# EAGLE schematic TFG_board_01 (EAGLE 7.6.0)
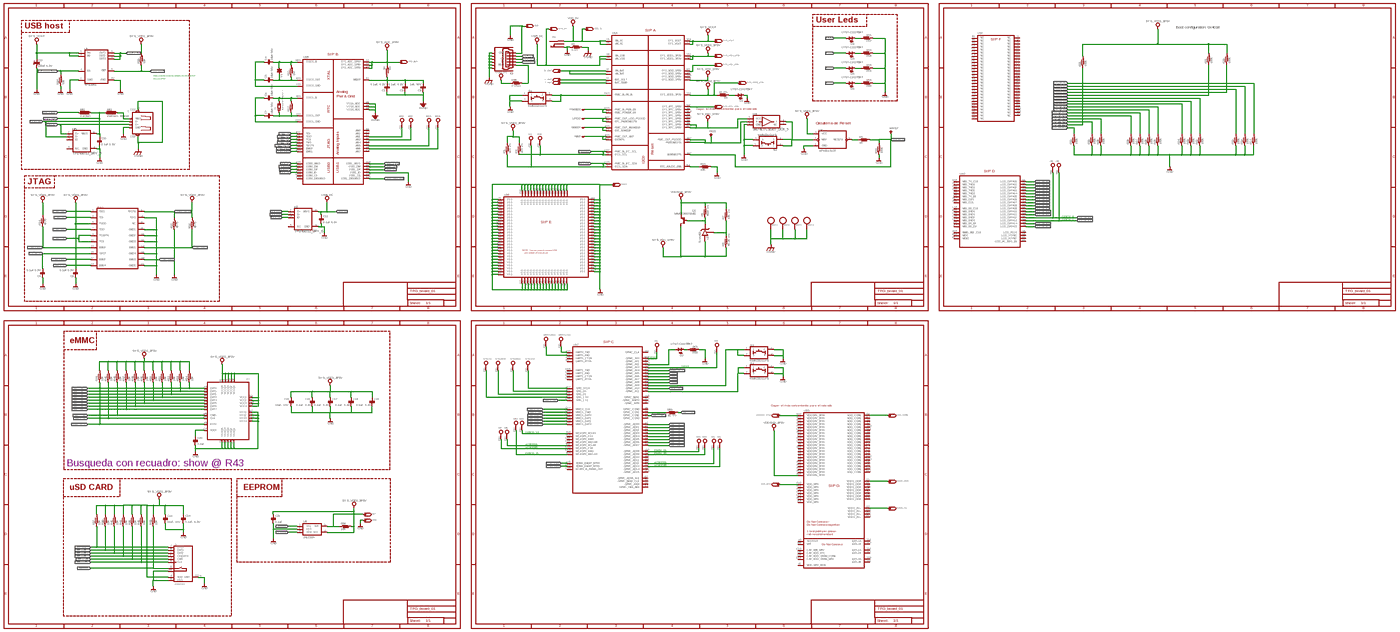
[diagram p0: schematic, sheet 1, overview]
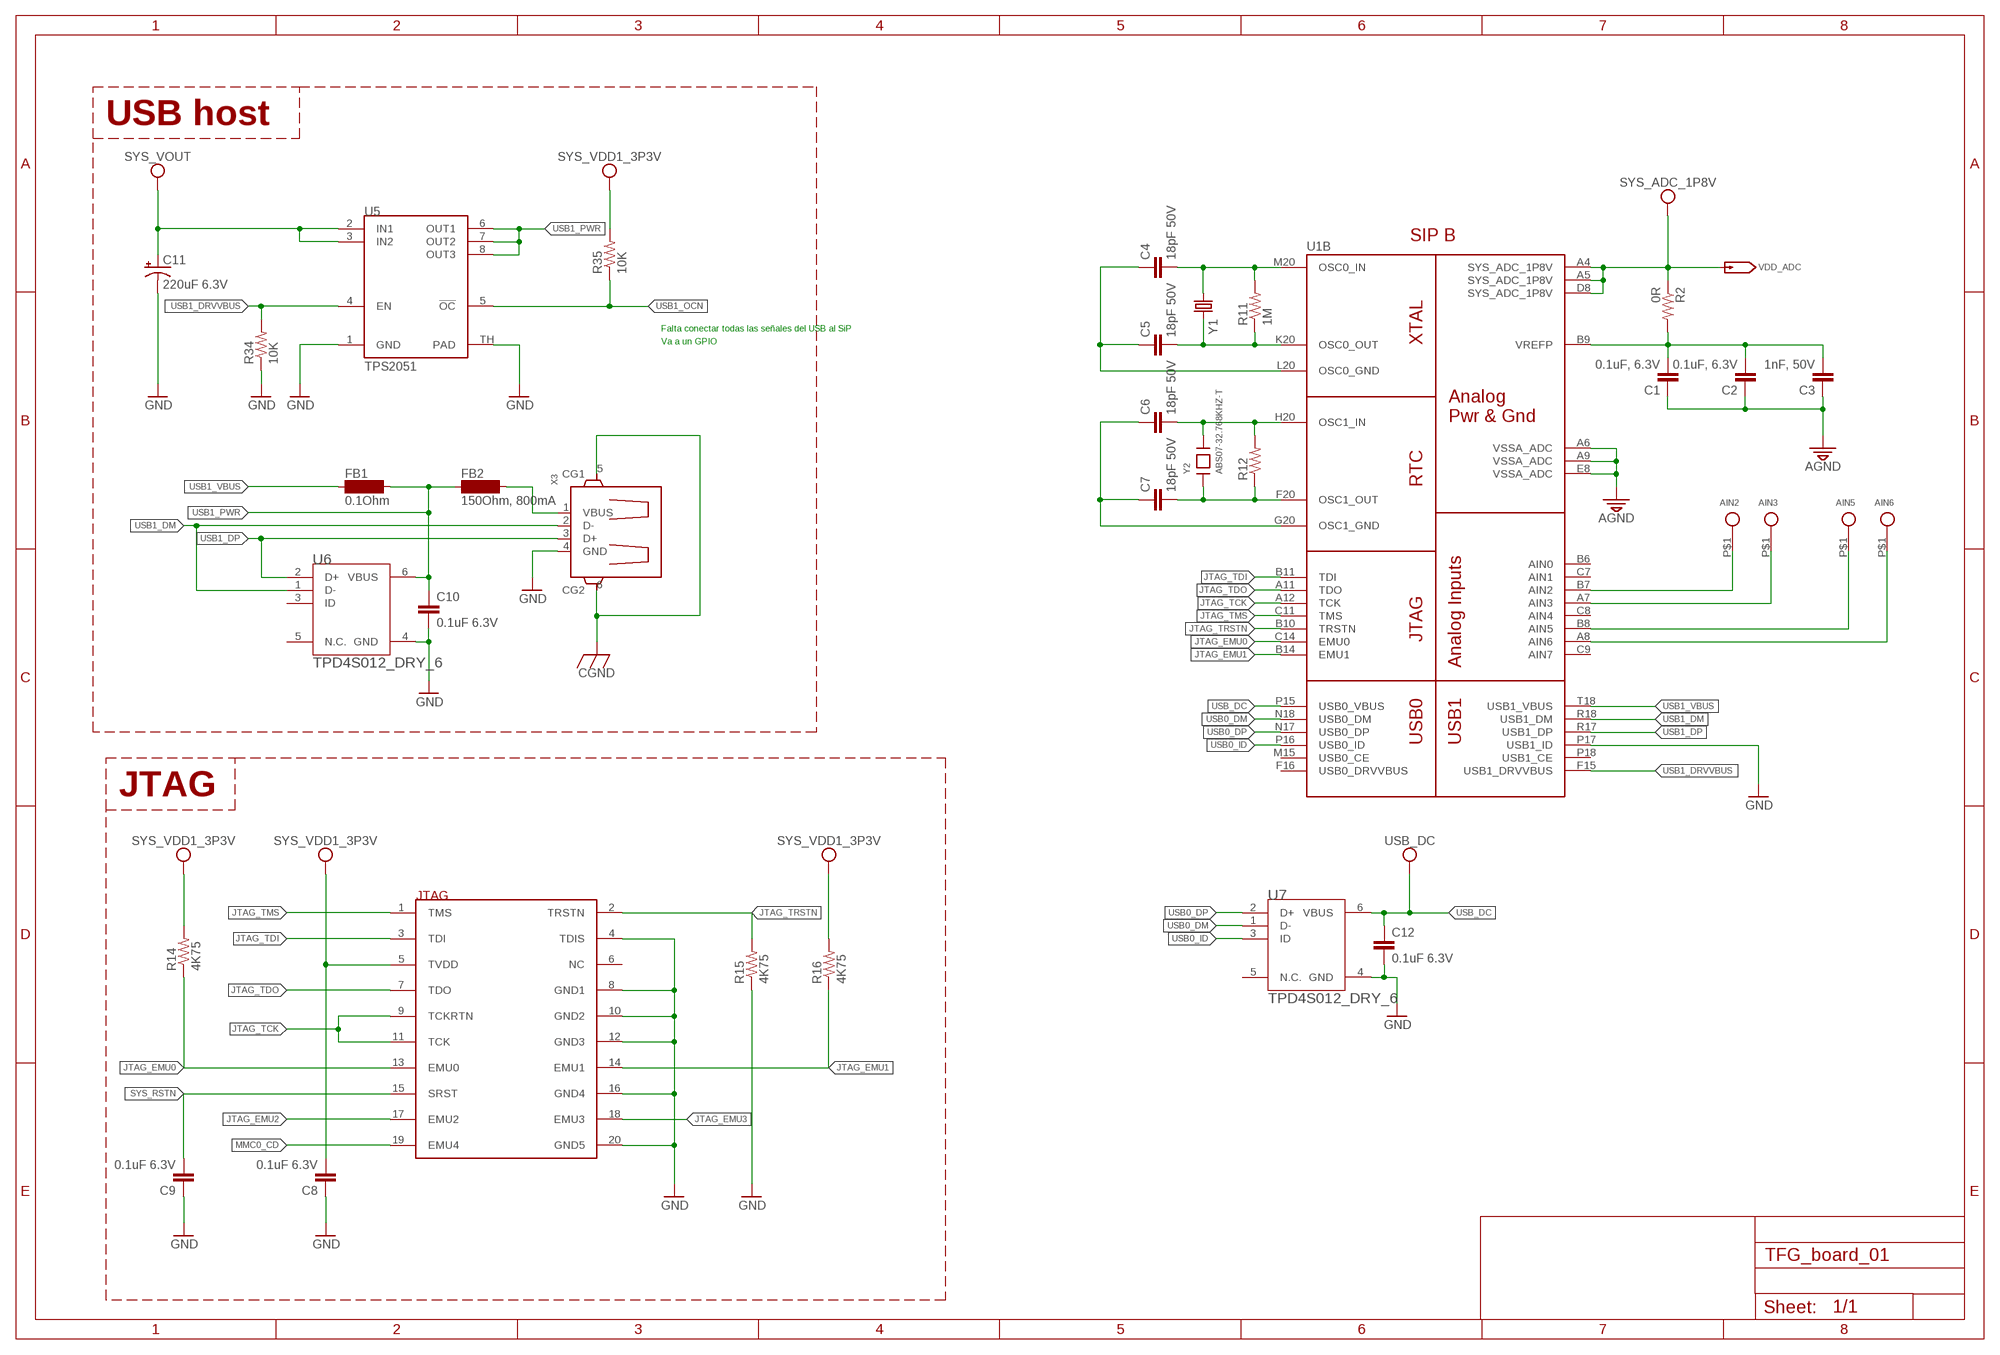
[diagram p1: schematic, sheet 1, part 1 of 7]
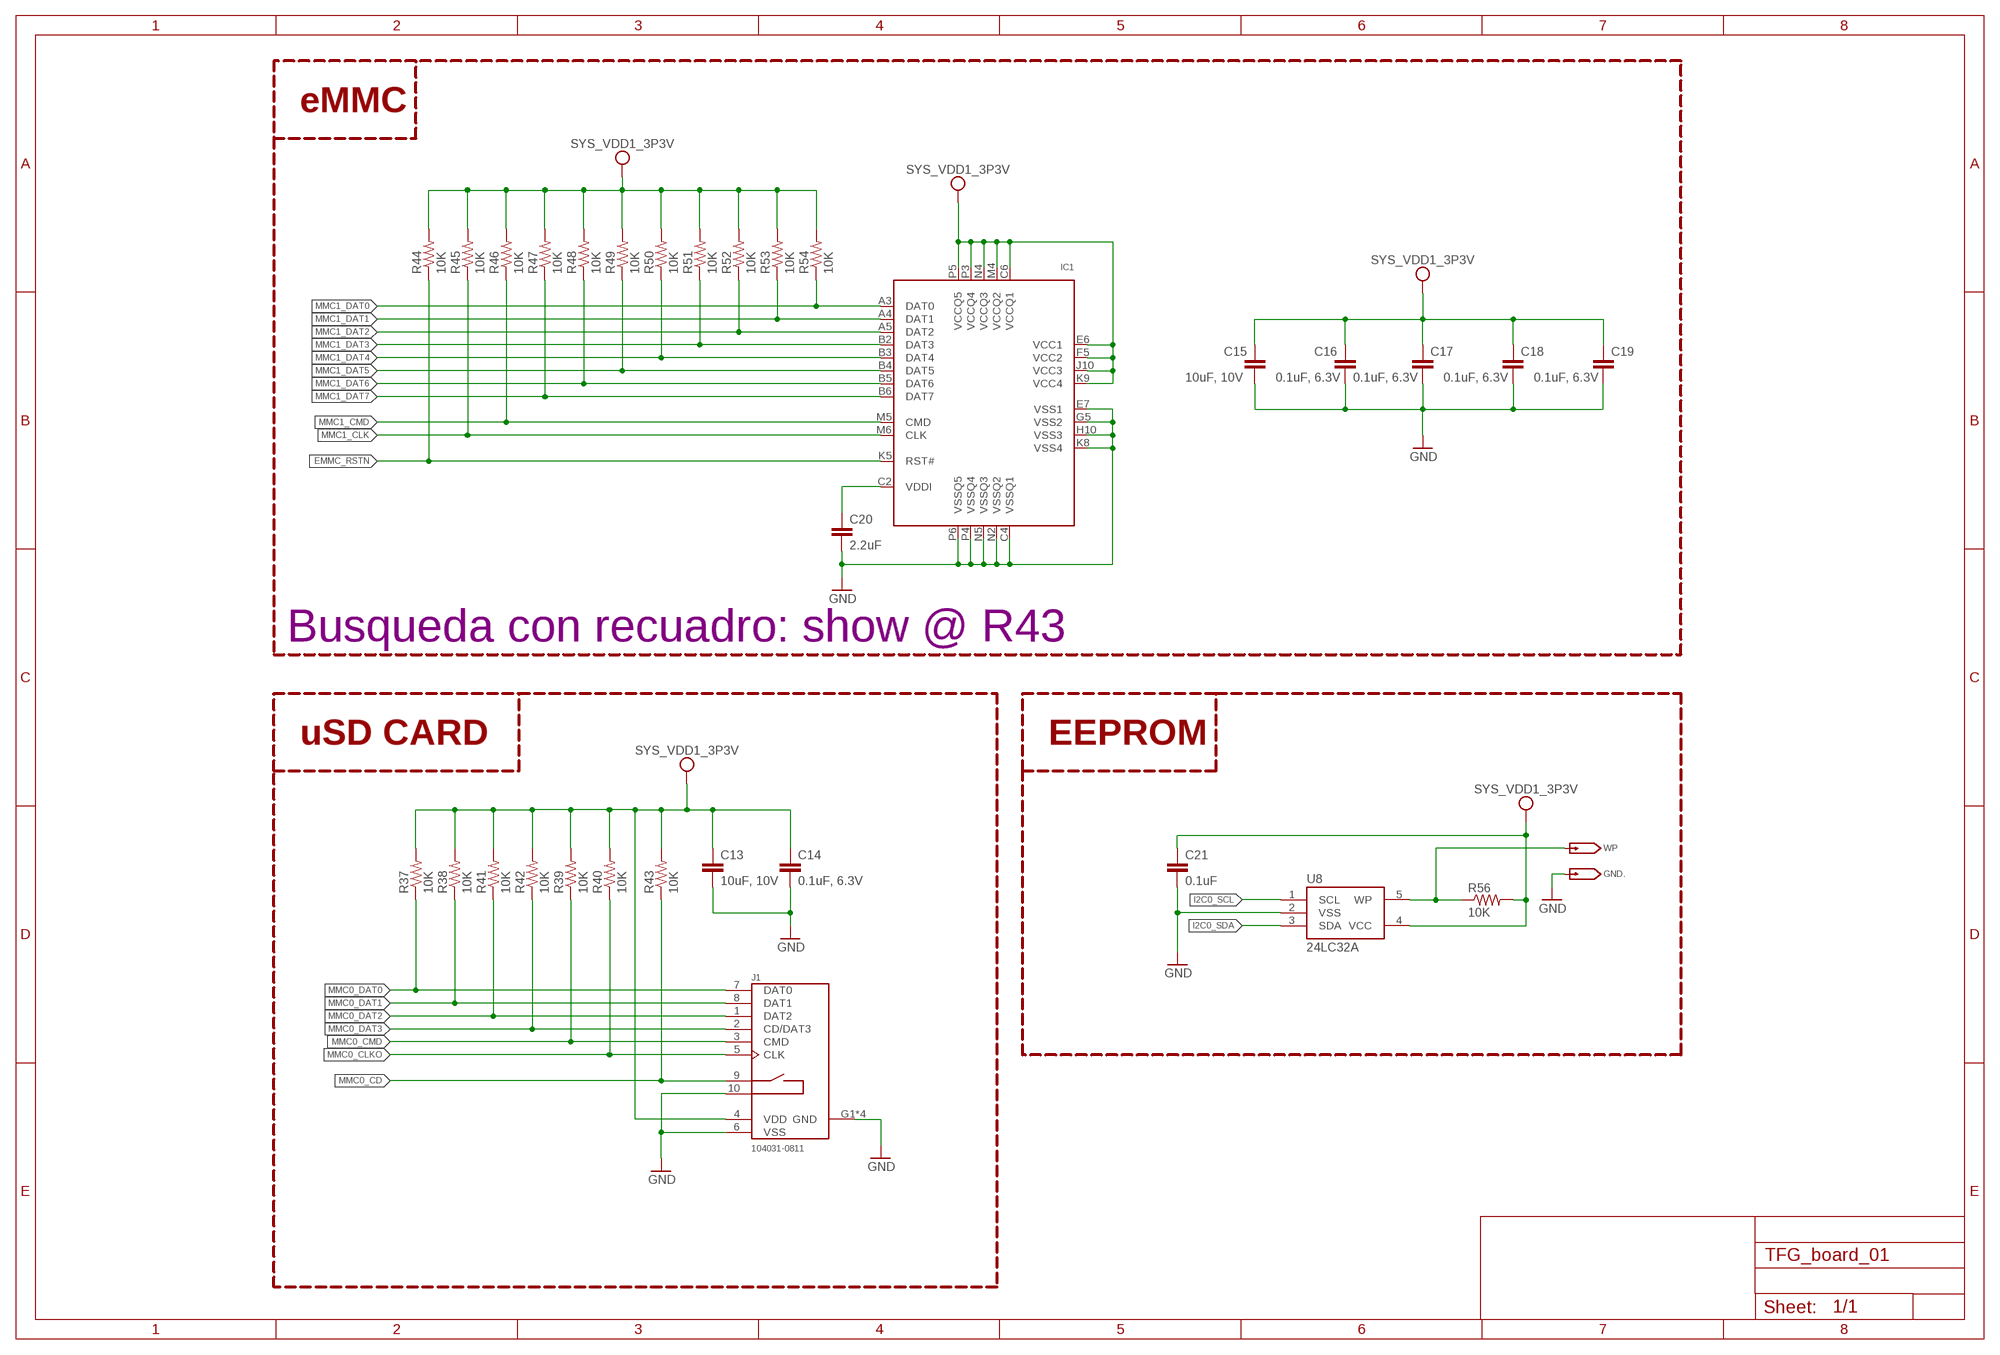
[diagram p2: schematic, sheet 1, part 2 of 7]
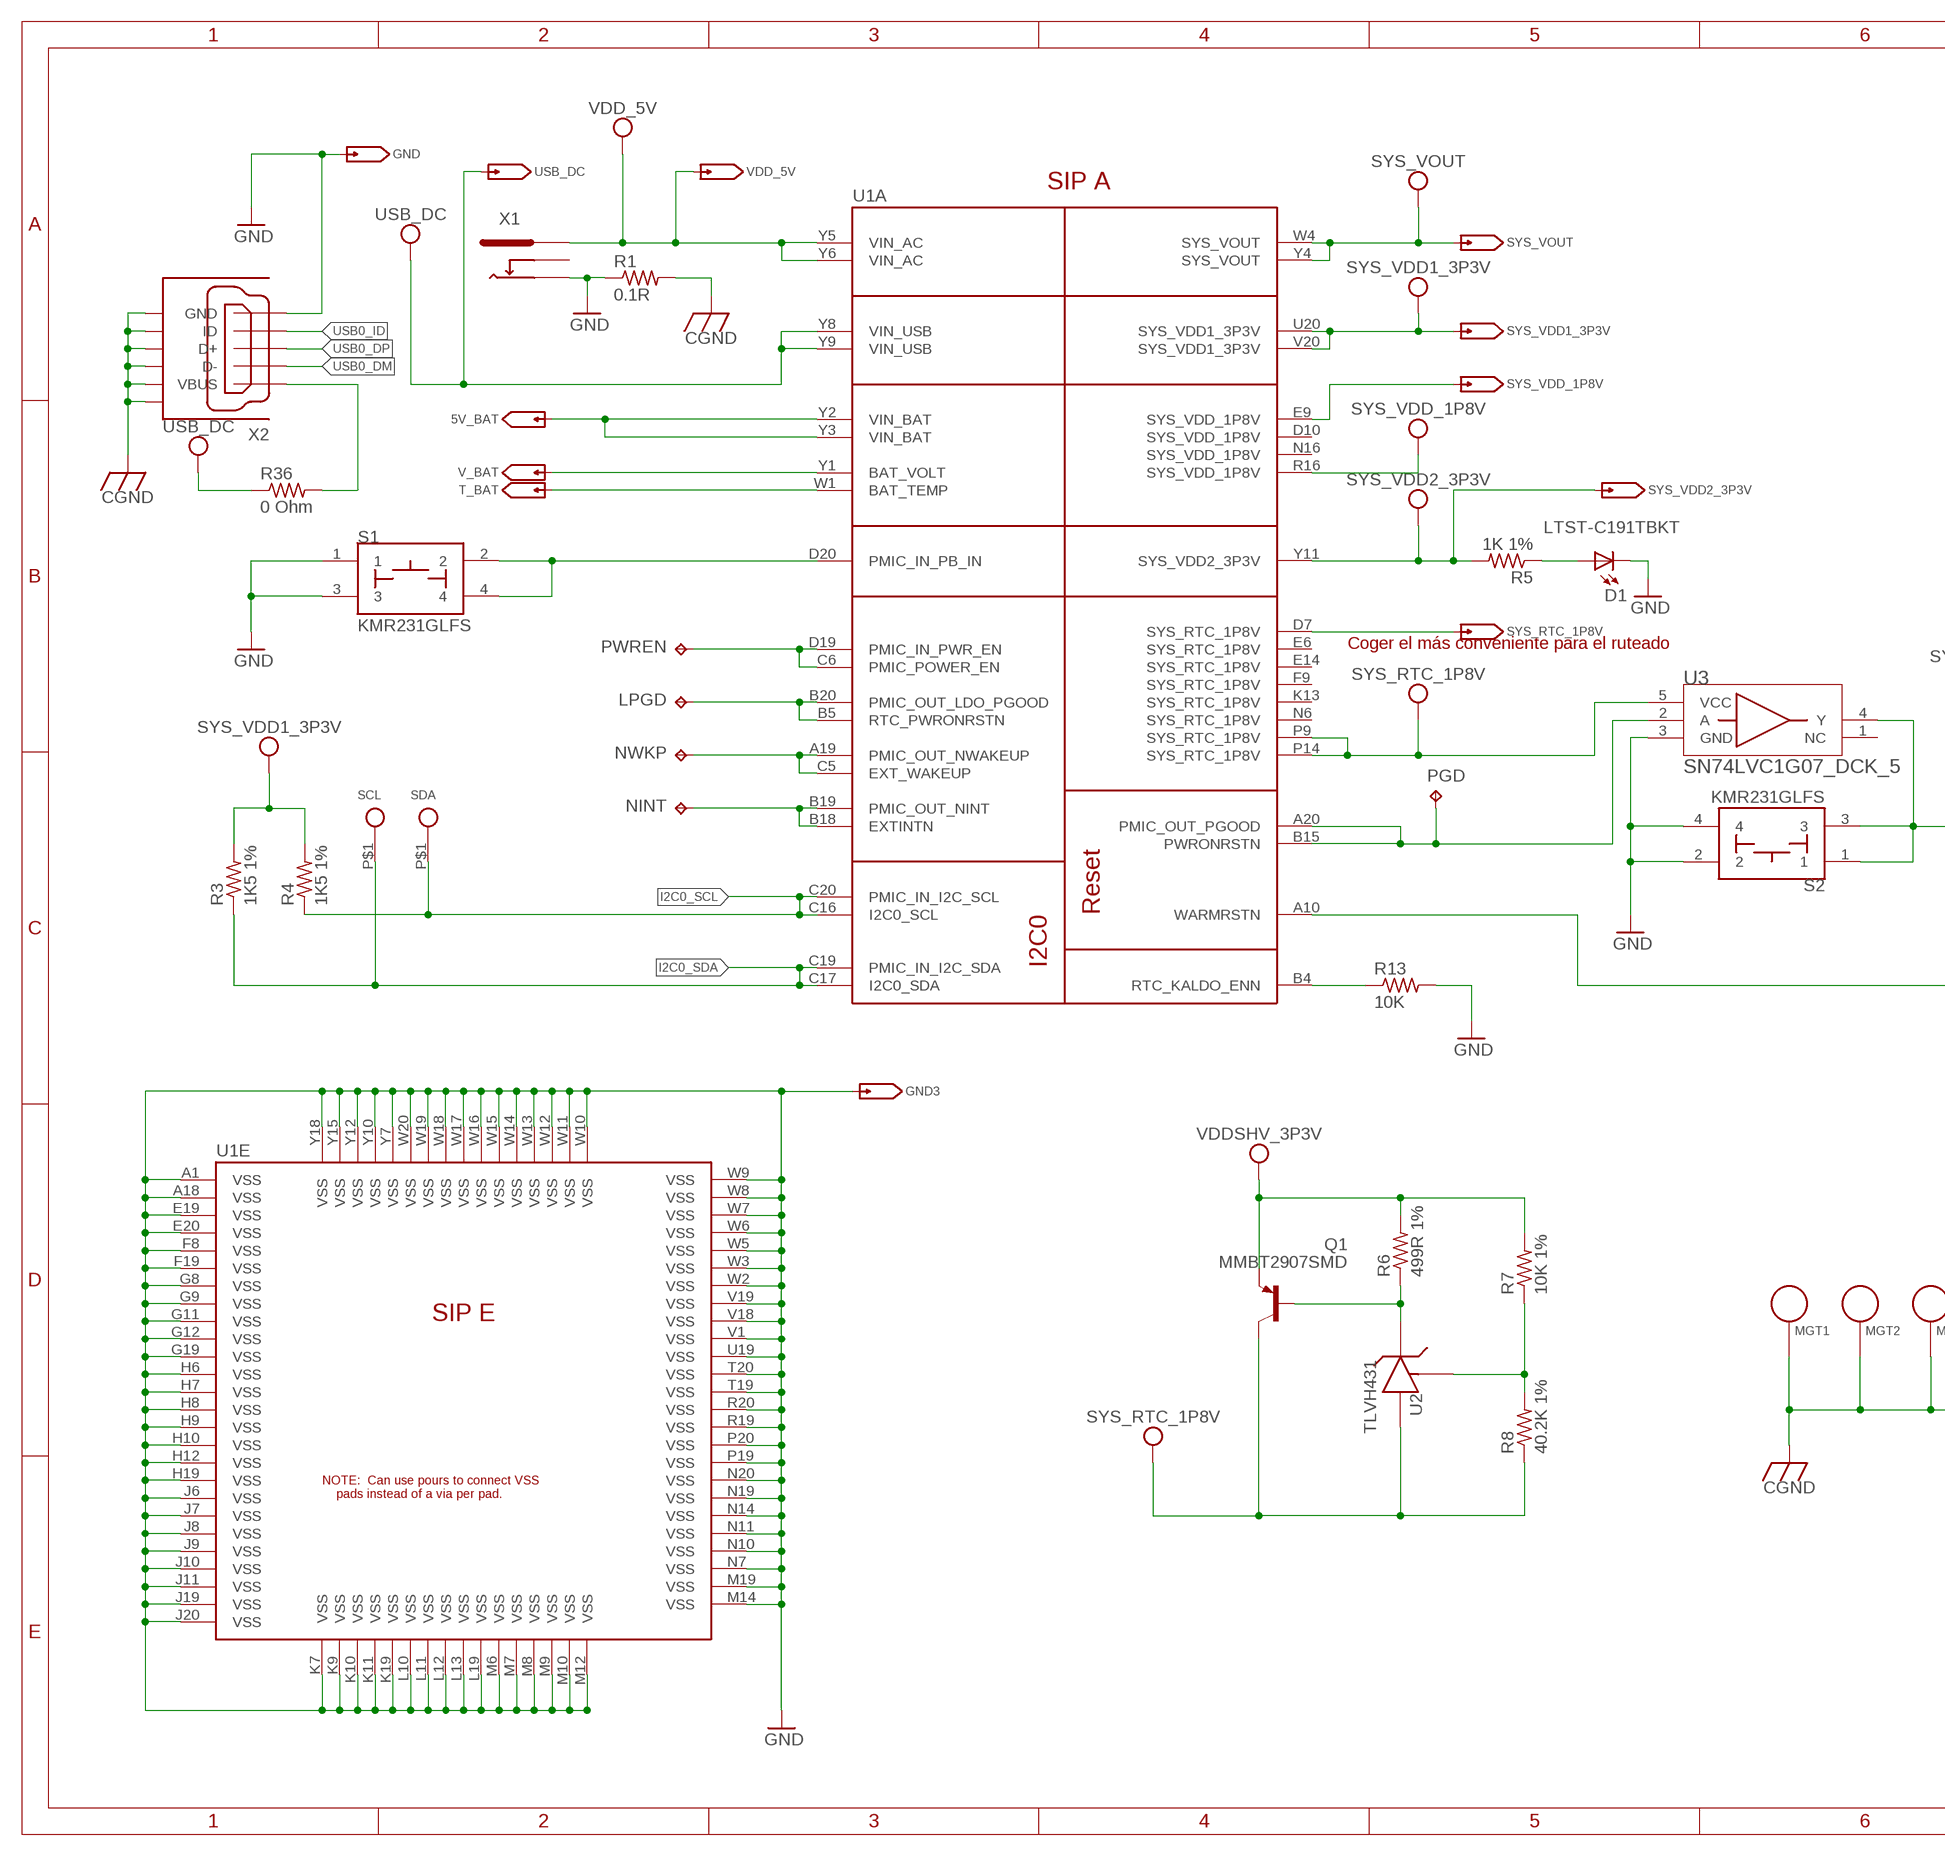
[diagram p3: schematic, sheet 1, part 3 of 7]
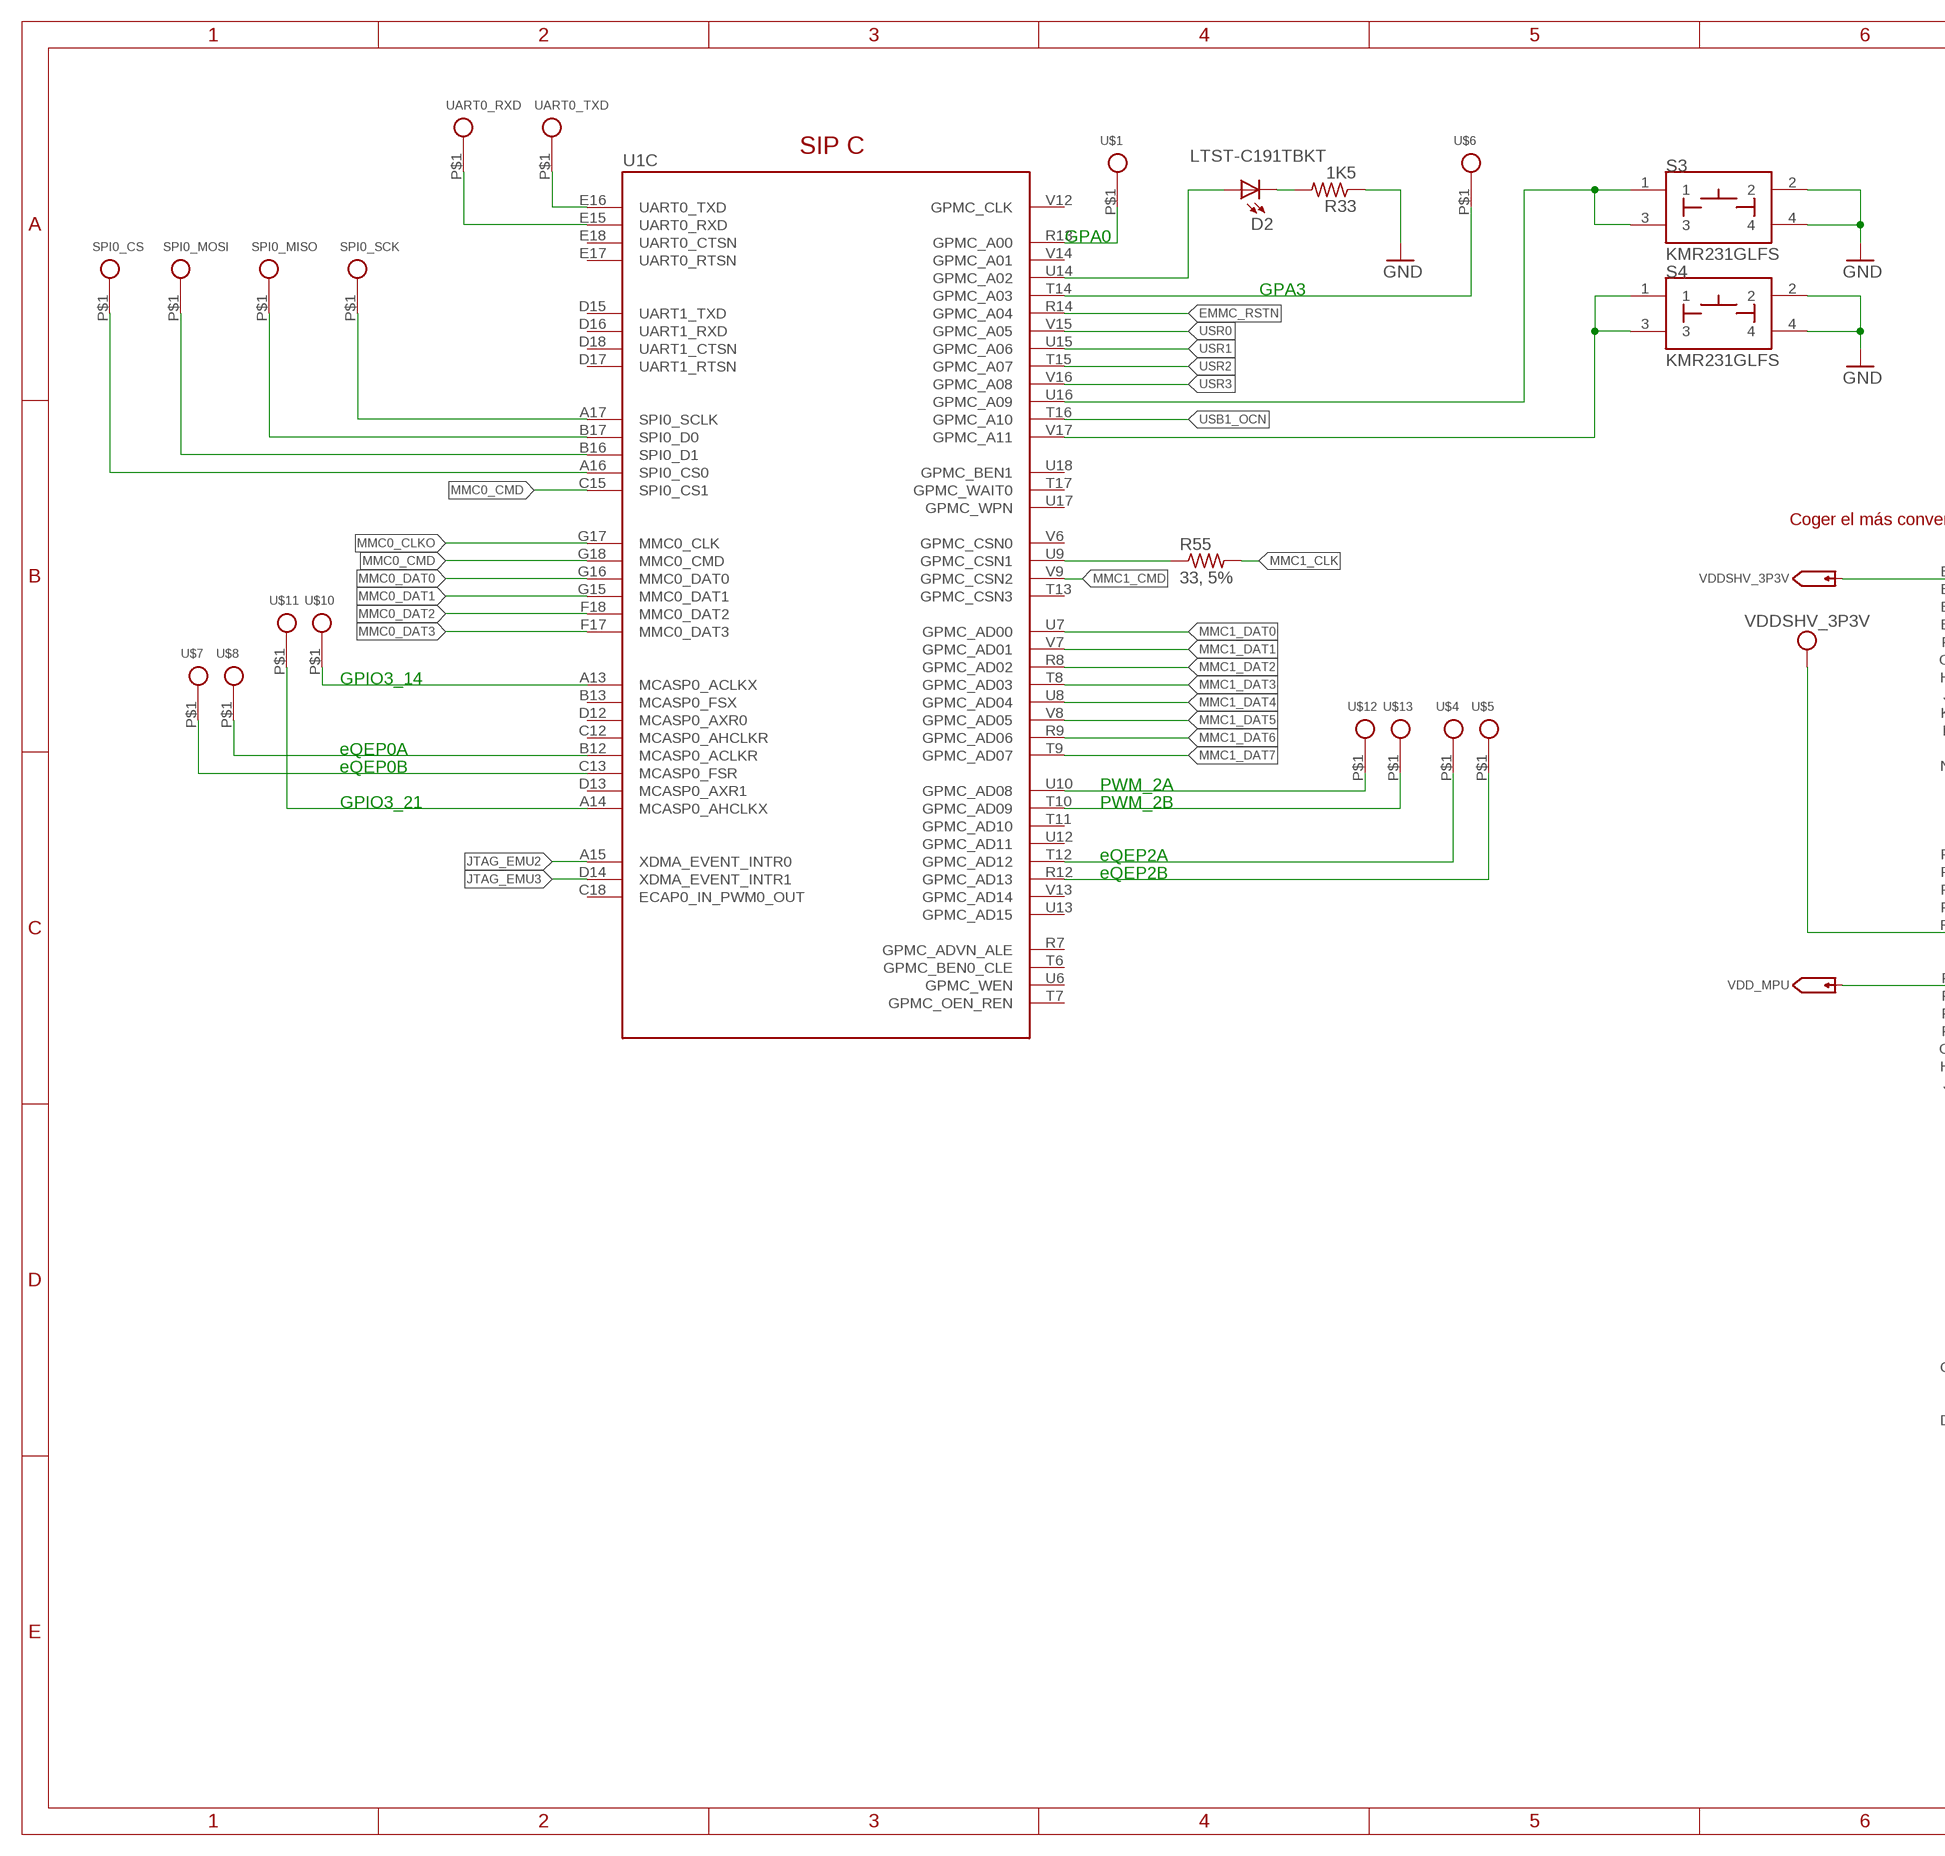
[diagram p4: schematic, sheet 1, part 4 of 7]
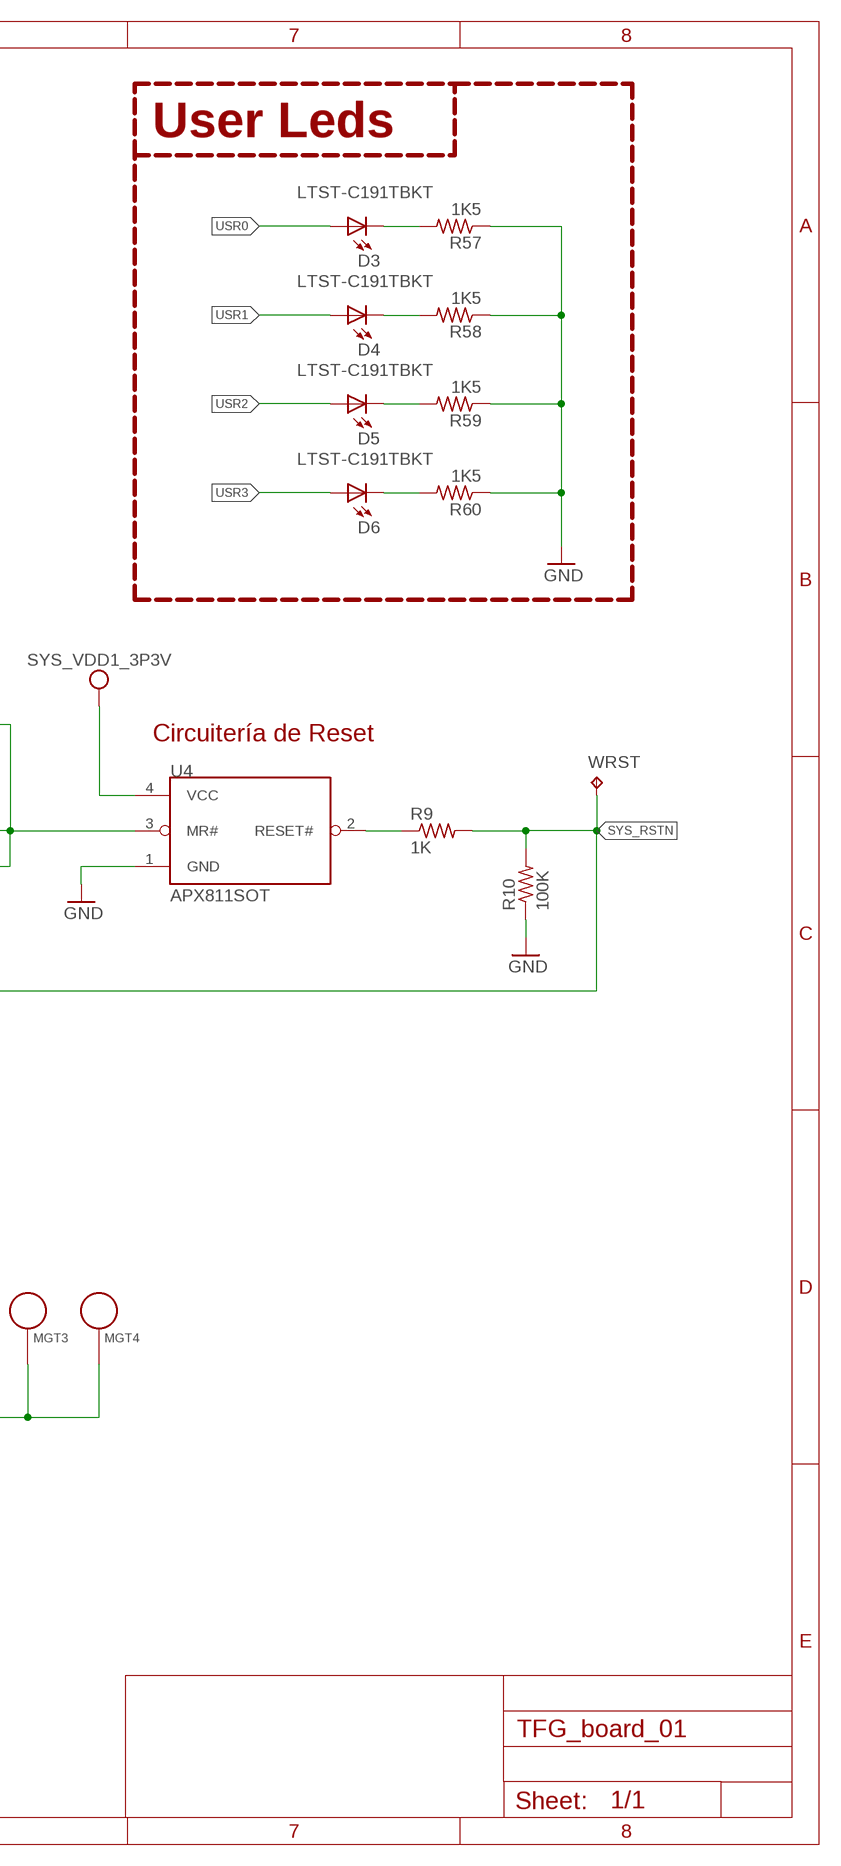
[diagram p5: schematic, sheet 1, part 5 of 7]
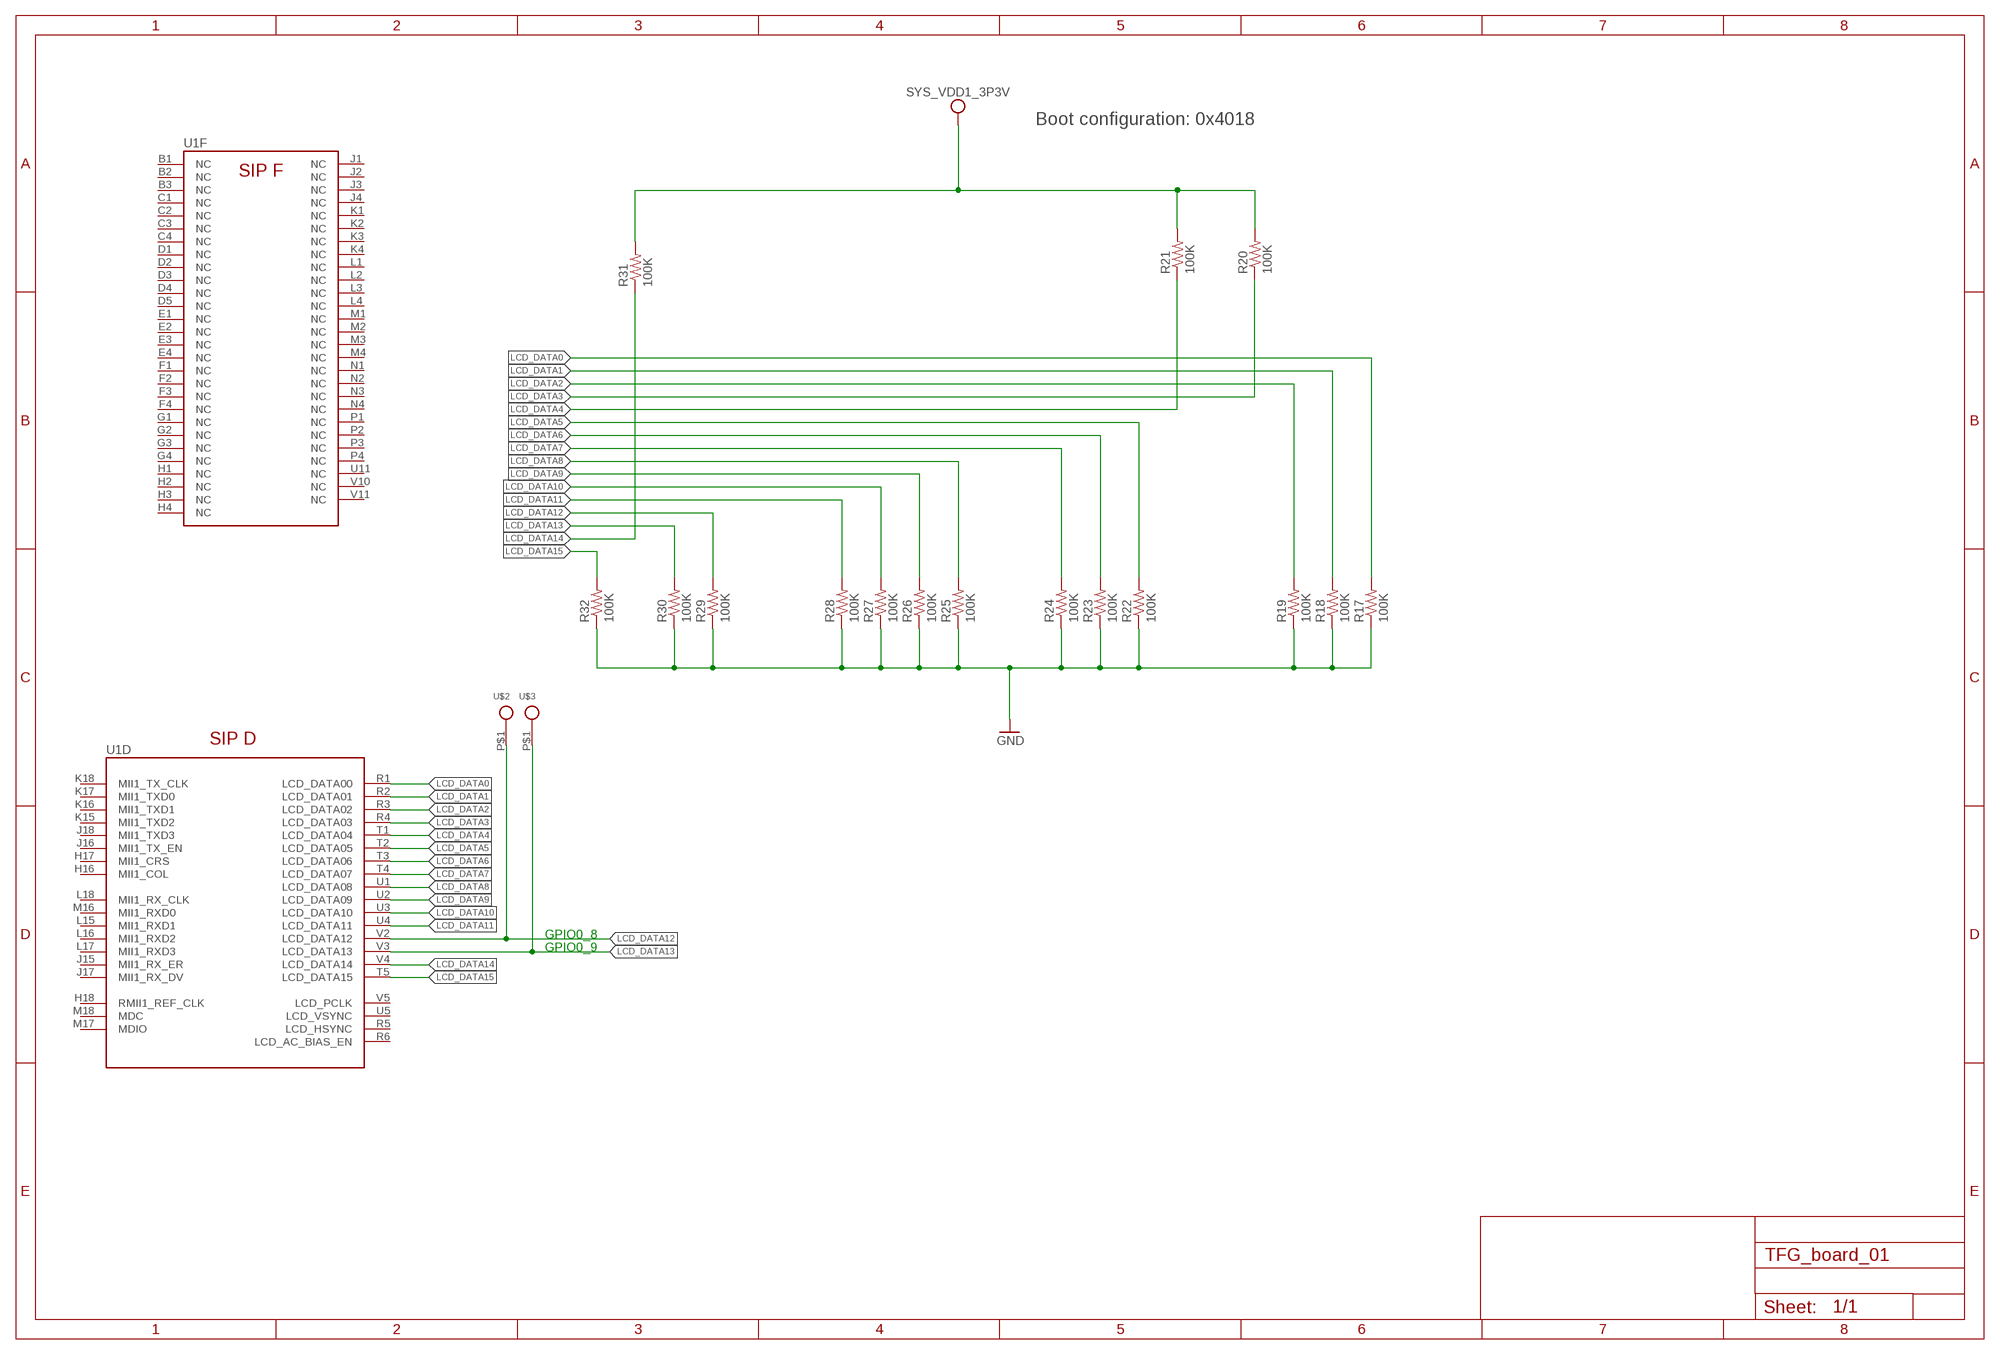
[diagram p6: schematic, sheet 1, part 6 of 7]
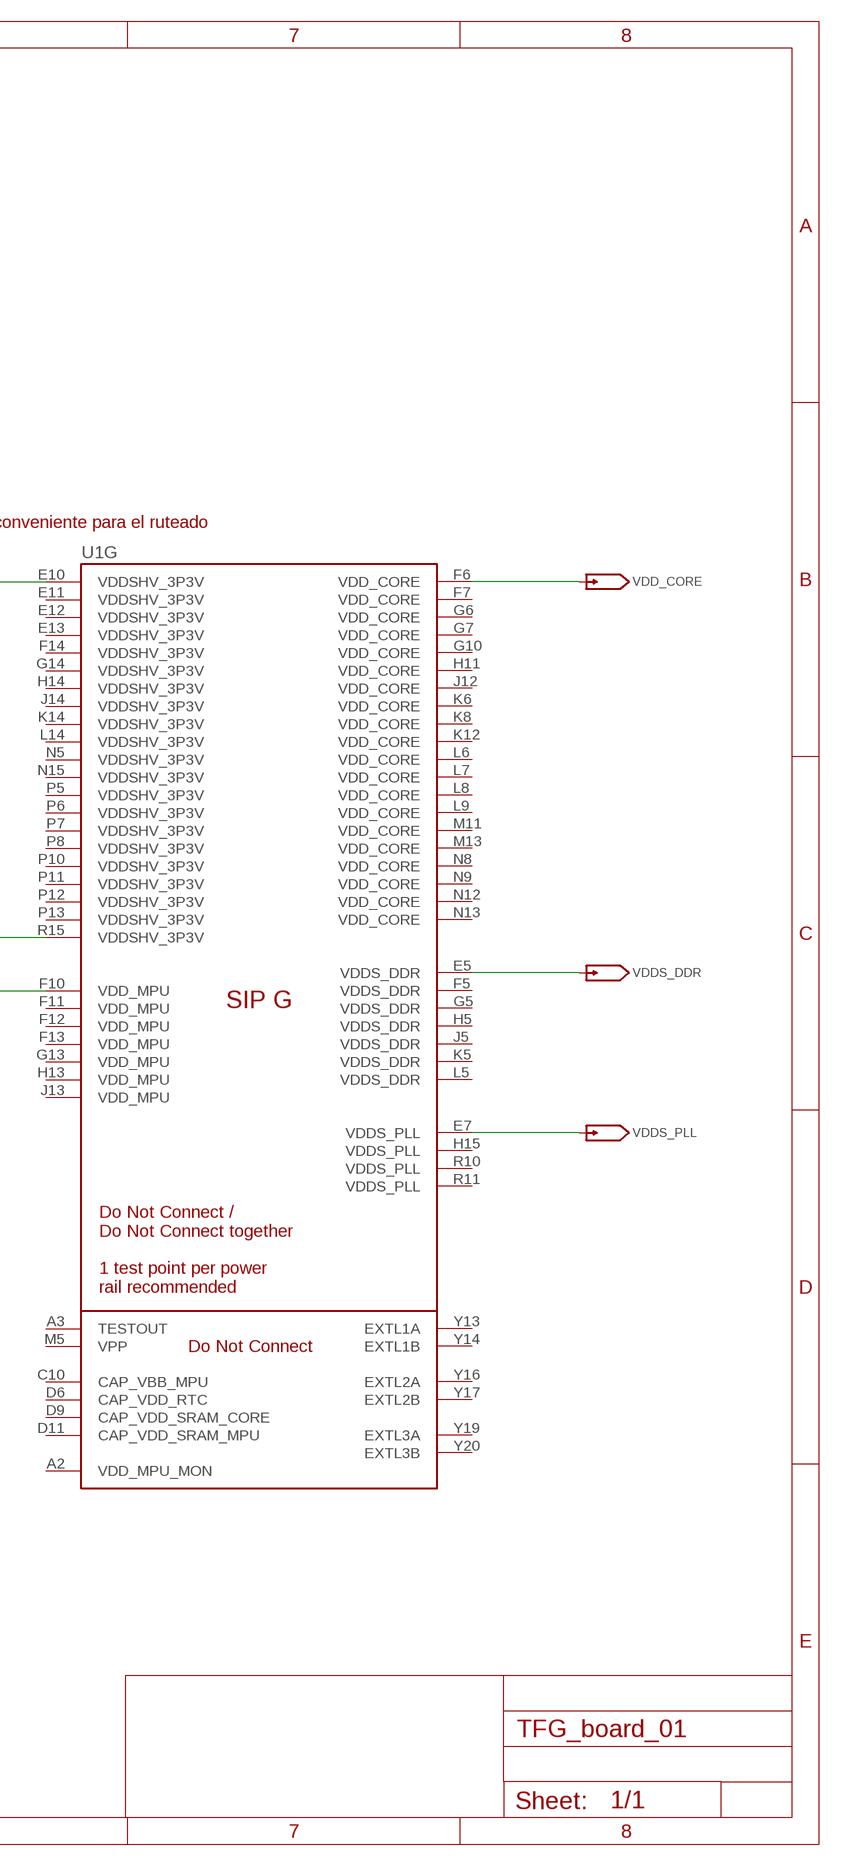
[diagram p7: schematic, sheet 1, part 7 of 7]

## Parts
5V_BAT  TESTPAD/W_HOLE_1X1  [TESTPAD/W_HOLE_1X1]
AIN2  HOLE  [HOLE]
AIN3  HOLE  [HOLE]
AIN5  HOLE  [HOLE]
AIN6  HOLE  [HOLE]
C1  0.1uF, 6.3V  CC0402  [C0402]
C2  0.1uF, 6.3V  CC0402  [C0402]
C3  1nF, 50V  CC0402  [C0402]
C4  18pF 50V  CC0402  [C0402]
C5  18pF 50V  CC0402  [C0402]
C6  18pF 50V  CC0402  [C0402]
C7  18pF 50V  CC0402  [C0402]
C8  0.1uF 6.3V  CC0402  [C0402]
C9  0.1uF 6.3V  CC0402  [C0402]
C10  0.1uF 6.3V  CC0402  [C0402]
C11  220uF 6.3V  CPOL-USB/3528-21R  [B/3528-21R]
C12  0.1uF 6.3V  CC0402  [C0402]
C13  10uF, 10V  CC0805  [C0805]
C14  0.1uF, 6.3V  CC0402  [C0402]
C15  10uF, 10V  CC0805  [C0805]
C16  0.1uF, 6.3V  CC0402  [C0402]
C17  0.1uF, 6.3V  CC0402  [C0402]
C18  0.1uF, 6.3V  CC0402  [C0402]
C19  0.1uF, 6.3V  CC0402  [C0402]
C20  2.2uF  CC0402  [C0402]
C21  0.1uF  CC0402  [C0402]
D1  LTST-C191TBKT  LTST-C191TBKTLED_EIA-STD  [EIA-STD]
D2  LTST-C191TBKT  LTST-C191TBKTLED_EIA-STD  [EIA-STD]
D3  LTST-C191TBKT  LTST-C191TBKTLED_EIA-STD  [EIA-STD]
D4  LTST-C191TBKT  LTST-C191TBKTLED_EIA-STD  [EIA-STD]
D5  LTST-C191TBKT  LTST-C191TBKTLED_EIA-STD  [EIA-STD]
D6  LTST-C191TBKT  LTST-C191TBKTLED_EIA-STD  [EIA-STD]
FB1  0.1Ohm  MPZ2012S601AT000FB_0805  [C0805]
FB2  150Ohm, 800mA  MPZ2012S601AT000FB_0805  [C0805]
GND  TESTPAD/W_HOLE_1X1  [TESTPAD/W_HOLE_1X1]
GND3  TESTPAD/W_HOLE_1X1  [TESTPAD/W_HOLE_1X1]
GND.  TESTPAD/W_HOLE_1X1  [TESTPAD/W_HOLE_1X1]
IC1  EMMC04G-S100-B08U  [MICRON_EMMC_153]
J1  104031-0811  [MOLEX_104031-0811]
JTAG  CTI-JTAG  [CTI-JTAG]
LPGD  TPTP15R  [TP15R]
MGT1  MOUNTING_HOLE  [MOUNTING_HOLE]
MGT2  MOUNTING_HOLE  [MOUNTING_HOLE]
MGT3  MOUNTING_HOLE  [MOUNTING_HOLE]
MGT4  MOUNTING_HOLE  [MOUNTING_HOLE]
NINT  TPTP15R  [TP15R]
NWKP  TPTP15R  [TP15R]
PGD  TPTP15R  [TP15R]
PWREN  TPTP15R  [TP15R]
Q1  MMBT2907SMD  [SOT23-BEC]
R1  0.1R  R-US_R0805  [R0805]
R2  0R  R-US_R0402  [R0402]
R3  1K5 1%  R-US_R0402  [R0402]
R4  1K5 1%  R-US_R0402  [R0402]
R5  1K 1%  R-US_R0402  [R0402]
R6  499R 1%  R-US_R0402  [R0402]
R7  10K 1%  R-US_R0402  [R0402]
R8  40.2K 1%  R-US_R0402  [R0402]
R9  1K  R-US_R0402  [R0402]
R10  100K  R-US_R0402  [R0402]
R11  1M  R-US_R0402  [R0402]
R12  R-US_R0402  [R0402]
R13  10K  R-US_R0402  [R0402]
R14  4K75  R-US_R0402  [R0402]
R15  4K75  R-US_R0402  [R0402]
R16  4K75  R-US_R0402  [R0402]
R17  100K  R-US_R0402  [R0402]
R18  100K  R-US_R0402  [R0402]
R19  100K  R-US_R0402  [R0402]
R20  100K  R-US_R0402  [R0402]
R21  100K  R-US_R0402  [R0402]
R22  100K  R-US_R0402  [R0402]
R23  100K  R-US_R0402  [R0402]
R24  100K  R-US_R0402  [R0402]
R25  100K  R-US_R0402  [R0402]
R26  100K  R-US_R0402  [R0402]
R27  100K  R-US_R0402  [R0402]
R28  100K  R-US_R0402  [R0402]
R29  100K  R-US_R0402  [R0402]
R30  100K  R-US_R0402  [R0402]
R31  100K  R-US_R0402  [R0402]
R32  100K  R-US_R0402  [R0402]
R33  1K5  R-US_R0402  [R0402]
R34  10K  R-US_R0402  [R0402]
R35  10K  R-US_R0402  [R0402]
R36  0 Ohm  R-US_R0805  [R0805]
R37  10K  R-US_R0402  [R0402]
R38  10K  R-US_R0402  [R0402]
R39  10K  R-US_R0402  [R0402]
R40  10K  R-US_R0402  [R0402]
R41  10K  R-US_R0402  [R0402]
R42  10K  R-US_R0402  [R0402]
R43  10K  R-US_R0402  [R0402]
R44  10K  R-US_R0402  [R0402]
R45  10K  R-US_R0402  [R0402]
R46  10K  R-US_R0402  [R0402]
R47  10K  R-US_R0402  [R0402]
R48  10K  R-US_R0402  [R0402]
R49  10K  R-US_R0402  [R0402]
R50  10K  R-US_R0402  [R0402]
R51  10K  R-US_R0402  [R0402]
R52  10K  R-US_R0402  [R0402]
R53  10K  R-US_R0402  [R0402]
R54  10K  R-US_R0402  [R0402]
R55  33, 5%  R-US_R0402  [R0402]
R56  10K  R-US_R0402  [R0402]
R57  1K5  R-US_R0402  [R0402]
R58  1K5  R-US_R0402  [R0402]
R59  1K5  R-US_R0402  [R0402]
R60  1K5  R-US_R0402  [R0402]
S1  KMR231GLFS  [SW4SMD_63X161LS]
S2  KMR231GLFS  [SW4SMD_63X161LS]
S3  KMR231GLFS  [SW4SMD_63X161LS]
S4  KMR231GLFS  [SW4SMD_63X161LS]
SCL  HOLE  [HOLE]
SDA  HOLE  [HOLE]
SPI0_CS  HOLE  [HOLE]
SPI0_MISO  HOLE  [HOLE]
SPI0_MOSI  HOLE  [HOLE]
SPI0_SCK  HOLE  [HOLE]
SYS_RTC_1P8V  TESTPAD/W_HOLE_1X1  [TESTPAD/W_HOLE_1X1]
SYS_VDD1_3P3V  TESTPAD/W_HOLE_1X1  [TESTPAD/W_HOLE_1X1]
SYS_VDD2_3P3V  TESTPAD/W_HOLE_1X1  [TESTPAD/W_HOLE_1X1]
SYS_VDD_1P8V  TESTPAD/W_HOLE_1X1  [TESTPAD/W_HOLE_1X1]
SYS_VOUT  TESTPAD/W_HOLE_1X1  [TESTPAD/W_HOLE_1X1]
T_BAT  TESTPAD/W_HOLE_1X1  [TESTPAD/W_HOLE_1X1]
U1  OSD3358-512M-BAS  [OSD335X-BGA-400]
U2  TLVH431  [SOT23-3]
U3  SN74LVC1G07_DCK_5  [DCK5]
U4  APX811SOT  [SOT143-R]
U5  TPS2051  [S-PDSO-G08]
U6  TPD4S012_DRY_6  [DRY6]
U7  TPD4S012_DRY_6  [DRY6]
U8  24LC32A  [SOT23-5]
U$1  HOLE  [HOLE]
U$2  HOLE  [HOLE]
U$3  HOLE  [HOLE]
U$4  HOLE  [HOLE]
U$5  HOLE  [HOLE]
U$6  HOLE  [HOLE]
U$7  HOLE  [HOLE]
U$8  HOLE  [HOLE]
U$10  HOLE  [HOLE]
U$11  HOLE  [HOLE]
U$12  HOLE  [HOLE]
U$13  HOLE  [HOLE]
UART0_RXD  HOLE  [HOLE]
UART0_TXD  HOLE  [HOLE]
USB_DC  TESTPAD/W_HOLE_1X1  [TESTPAD/W_HOLE_1X1]
V_BAT  TESTPAD/W_HOLE_1X1  [TESTPAD/W_HOLE_1X1]
VDD_5V  TESTPAD/W_HOLE_1X1  [TESTPAD/W_HOLE_1X1]
VDD_ADC  TESTPAD/W_HOLE_1X1  [TESTPAD/W_HOLE_1X1]
VDD_CORE  TESTPAD/W_HOLE_1X1  [TESTPAD/W_HOLE_1X1]
VDD_MPU  TESTPAD/W_HOLE_1X1  [TESTPAD/W_HOLE_1X1]
VDDS_DDR  TESTPAD/W_HOLE_1X1  [TESTPAD/W_HOLE_1X1]
VDDS_PLL  TESTPAD/W_HOLE_1X1  [TESTPAD/W_HOLE_1X1]
VDDSHV_3P3V  TESTPAD/W_HOLE_1X1  [TESTPAD/W_HOLE_1X1]
WP  TESTPAD/W_HOLE_1X1  [TESTPAD/W_HOLE_1X1]
WRST  TPTP15R  [TP15R]
X1  PJ-102B_POWER_CON  [PJ-102B_POWER_CON]
X2  10118192-0001LF  [10118192-0001LF(MICRO-USB-B-AMPHENOL-FCI)]
X3  USB_HOST_W/CHASSIS_GND  [USB_HOST_HORIZONTAL_W/CHASSIS_GND]
Y1  7A-24.000MAAJ-T  [CRYSTAL-TXC-7A]
Y2  ABS07-32.768KHZ-T  [CRYSTAL_3.2X1.5]

## Nets
AGND: C1.1 C2.1 C3.1 U1.A6(B:VSSA_ADC) U1.A9(B:VSSA_ADC) U1.E8(B:VSSA_ADC)
CGND: MGT1.P$1 MGT2.P$1 MGT3.P$1 MGT4.P$1 R1.2 X2.CGND1(SGND1) X2.CGND2(SGND2) X2.CGND3(SGND3) X2.CGND4(SGND4) X2.CGND5(SGND5) X2.CGND6(SGND6) X3.5(CG1) X3.6(CG2)
CS: SPI0_CS.P$1 U1.A16(C:SPI0_CS0)
EMMC_RSTN: IC1.K5(RST#) R44.1 U1.R14(C:GPMC_A04)
GND: C8.1 C9.1 C10.2 C11.- C12.2 C13.2 C14.2 C15.2 C16.2 C17.2 C18.2 C19.2 C20.2 C21.2 D1.2(C) GND3.P$1(TP) GND..P$1(TP) GND.P$1(TP) IC1.C4(VSSQ1) IC1.E7(VSS1) IC1.G5(VSS2) IC1.H10(VSS3) IC1.K8(VSS4) IC1.N2(VSSQ2) IC1.N5(VSSQ3) IC1.P4(VSSQ4) IC1.P6(VSSQ5) J1.6(VSS) J1.10(CARD_DET2) J1.G1(GND) J1.G2(GND) J1.G3(GND) J1.G4(GND) JTAG.4(TDIS) JTAG.8(GND1) JTAG.10(GND2) JTAG.12(GND3) JTAG.16(GND4) JTAG.20(GND5) R1.1 R10.1 R13.2 R15.1 R17.1 R18.1 R19.1 R22.1 R23.1 R24.1 R25.1 R26.1 R27.1 R28.1 R29.1 R30.1 R32.1 R33.1 R34.1 R57.1 R58.1 R59.1 R60.1 S1.1 S1.3 S2.2 S2.4 S3.2 S3.4 S4.2 S4.4 U1.A1(E:VSS) U1.A18(E:VSS) U1.E19(E:VSS) U1.E20(E:VSS) U1.F8(E:VSS) U1.F19(E:VSS) U1.G8(E:VSS) U1.G9(E:VSS) U1.G11(E:VSS) U1.G12(E:VSS) U1.G19(E:VSS) U1.H6(E:VSS) U1.H7(E:VSS) U1.H8(E:VSS) U1.H9(E:VSS) U1.H10(E:VSS) U1.H12(E:VSS) U1.H19(E:VSS) U1.J6(E:VSS) U1.J7(E:VSS) U1.J8(E:VSS) U1.J9(E:VSS) U1.J10(E:VSS) U1.J11(E:VSS) U1.J19(E:VSS) U1.J20(E:VSS) U1.K7(E:VSS) U1.K9(E:VSS) U1.K10(E:VSS) U1.K11(E:VSS) U1.K19(E:VSS) U1.L10(E:VSS) U1.L11(E:VSS) U1.L12(E:VSS) U1.L13(E:VSS) U1.L19(E:VSS) U1.M6(E:VSS) U1.M7(E:VSS) U1.M8(E:VSS) U1.M9(E:VSS) U1.M10(E:VSS) U1.M12(E:VSS) U1.M14(E:VSS) U1.M19(E:VSS) U1.N7(E:VSS) U1.N10(E:VSS) U1.N11(E:VSS) U1.N14(E:VSS) U1.N19(E:VSS) U1.N20(E:VSS) U1.P17(B:USB1_ID) U1.P19(E:VSS) U1.P20(E:VSS) U1.R19(E:VSS) U1.R20(E:VSS) U1.T19(E:VSS) U1.T20(E:VSS) U1.U19(E:VSS) U1.V1(E:VSS) U1.V18(E:VSS) U1.V19(E:VSS) U1.W2(E:VSS) U1.W3(E:VSS) U1.W5(E:VSS) U1.W6(E:VSS) U1.W7(E:VSS) U1.W8(E:VSS) U1.W9(E:VSS) U1.W10(E:VSS) U1.W11(E:VSS) U1.W12(E:VSS) U1.W13(E:VSS) U1.W14(E:VSS) U1.W15(E:VSS) U1.W16(E:VSS) U1.W17(E:VSS) U1.W18(E:VSS) U1.W19(E:VSS) U1.W20(E:VSS) U1.Y7(E:VSS) U1.Y10(E:VSS) U1.Y12(E:VSS) U1.Y15(E:VSS) U1.Y18(E:VSS) U3.3(GND) U4.1(GND) U5.1(GND) U5.TH(PAD) U6.4(GND) U7.4(GND) U8.2(VSS) X1.OUT X2.GND X3.4(GND)
I2C0_SCL: R4.1 SDA.P$1 U1.C16(A:I2C0_SCL) U1.C20(A:PMIC_IN_I2C_SCL) U8.1(SCL)
I2C0_SDA: R3.1 SCL.P$1 U1.C17(A:I2C0_SDA) U1.C19(A:PMIC_IN_I2C_SDA) U8.3(SDA)
JTAG_EMU0: JTAG.13(EMU0) R14.1 U1.C14(B:EMU0)
JTAG_EMU1: JTAG.14(EMU1) R16.1 U1.B14(B:EMU1)
JTAG_EMU2: JTAG.17(EMU2) U1.A15(C:XDMA_EVENT_INTR0)
JTAG_EMU3: JTAG.18(EMU3) U1.D14(C:XDMA_EVENT_INTR1)
JTAG_TCK: JTAG.9(TCKRTN) JTAG.11(TCK) U1.A12(B:TCK)
JTAG_TDI: JTAG.3(TDI) U1.B11(B:TDI)
JTAG_TDO: JTAG.7(TDO) U1.A11(B:TDO)
JTAG_TMS: JTAG.1(TMS) U1.C11(B:TMS)
JTAG_TRSTN: JTAG.2(TRSTN) R15.2 U1.B10(B:TRSTN)
LCD_DATA0: R17.2 U1.R1(D:LCD_DATA00)
LCD_DATA1: R18.2 U1.R2(D:LCD_DATA01)
LCD_DATA2: R19.2 U1.R3(D:LCD_DATA02)
LCD_DATA3: R20.1 U1.R4(D:LCD_DATA03)
LCD_DATA4: R21.1 U1.T1(D:LCD_DATA04)
LCD_DATA5: R22.2 U1.T2(D:LCD_DATA05)
LCD_DATA6: R23.2 U1.T3(D:LCD_DATA06)
LCD_DATA7: R24.2 U1.T4(D:LCD_DATA07)
LCD_DATA8: R25.2 U1.U1(D:LCD_DATA08)
LCD_DATA9: R26.2 U1.U2(D:LCD_DATA09)
LCD_DATA10: R27.2 U1.U3(D:LCD_DATA10)
LCD_DATA11: R28.2 U1.U4(D:LCD_DATA11)
LCD_DATA12: R29.2 U1.V2(D:LCD_DATA12) U$2.P$1
LCD_DATA13: R30.2 U1.V3(D:LCD_DATA13) U$3.P$1
LCD_DATA14: R31.1 U1.V4(D:LCD_DATA14)
LCD_DATA15: R32.2 U1.T5(D:LCD_DATA15)
MISO: SPI0_MISO.P$1 U1.B17(C:SPI0_D0)
MMC0_CD: J1.9(CARD_DET1) JTAG.19(EMU4) R43.1
MMC0_CLKO: J1.5(CLK) R40.1 U1.G17(C:MMC0_CLK)
MMC0_CMD: J1.3(CMD) R39.1 U1.C15(C:SPI0_CS1) U1.G18(C:MMC0_CMD)
MMC0_DAT0: J1.7(DAT0) R37.1 U1.G16(C:MMC0_DAT0)
MMC0_DAT1: J1.8(DAT1) R38.1 U1.G15(C:MMC0_DAT1)
MMC0_DAT2: J1.1(DAT2) R41.1 U1.F18(C:MMC0_DAT2)
MMC0_DAT3: J1.2(CD/DAT3) R42.1 U1.F17(C:MMC0_DAT3)
MMC1_CLK: IC1.M6(CLK) R45.1 R55.2
MMC1_CMD: IC1.M5(CMD) R46.1 U1.V9(C:GPMC_CSN2)
MMC1_DAT0: IC1.A3(DAT0) R54.1 U1.U7(C:GPMC_AD00)
MMC1_DAT1: IC1.A4(DAT1) R53.1 U1.V7(C:GPMC_AD01)
MMC1_DAT2: IC1.A5(DAT2) R52.1 U1.R8(C:GPMC_AD02)
MMC1_DAT3: IC1.B2(DAT3) R51.1 U1.T8(C:GPMC_AD03)
MMC1_DAT4: IC1.B3(DAT4) R50.1 U1.U8(C:GPMC_AD04)
MMC1_DAT5: IC1.B4(DAT5) R49.1 U1.V8(C:GPMC_AD05)
MMC1_DAT6: IC1.B5(DAT6) R48.1 U1.R9(C:GPMC_AD06)
MMC1_DAT7: IC1.B6(DAT7) R47.1 U1.T9(C:GPMC_AD07)
MOSI: SPI0_MOSI.P$1 U1.B16(C:SPI0_D1)
N$1: SYS_RTC_1P8V.P$1(TP) U1.D7(A:SYS_RTC_1P8V)
N$2: U1.E10(G:VDDSHV_3P3V) VDDSHV_3P3V.P$1(TP)
N$3: U1.T12(C:GPMC_AD12) U$4.P$1
N$4: 5V_BAT.P$1(TP) U1.Y2(A:VIN_BAT) U1.Y3(A:VIN_BAT)
N$5: U1.Y1(A:BAT_VOLT) V_BAT.P$1(TP)
N$6: T_BAT.P$1(TP) U1.W1(A:BAT_TEMP)
N$7: SYS_VDD_1P8V.P$1(TP) U1.E9(A:SYS_VDD_1P8V)
N$8: U1.F10(G:VDD_MPU) VDD_MPU.P$1(TP)
N$9: U1.F6(G:VDD_CORE) VDD_CORE.P$1(TP)
N$10: U1.E5(G:VDDS_DDR) VDDS_DDR.P$1(TP)
N$11: U1.E7(G:VDDS_PLL) VDDS_PLL.P$1(TP)
N$12: U1.R12(C:GPMC_AD13) U$5.P$1
N$13: PWREN.TP U1.C6(A:PMIC_POWER_EN) U1.D19(A:PMIC_IN_PWR_EN)
N$14: C1.2 C2.2 C3.2 R2.2 U1.B9(B:VREFP)
N$15: LPGD.TP U1.B5(A:RTC_PWRONRSTN) U1.B20(A:PMIC_OUT_LDO_PGOOD)
N$16: NWKP.TP U1.A19(A:PMIC_OUT_NWAKEUP) U1.C5(A:EXT_WAKEUP)
N$18: NINT.TP U1.B18(A:EXTINTN) U1.B19(A:PMIC_OUT_NINT)
N$19: S1.2 S1.4 U1.D20(A:PMIC_IN_PB_IN)
N$20: D1.1(A) R5.1
N$21: R7.1 R8.2 U2.1(REF)
N$22: PGD.TP U1.A20(A:PMIC_OUT_PGOOD) U1.B15(A:PWRONRSTN) U3.2(A)
N$23: Q1.B R6.1 U2.2(CATHODE)
N$26: S2.1 S2.3 U3.4(Y) U4.3(MR#)
N$27: R9.1 U4.2(RESET#)
N$28: D2.1(A) U1.U14(C:GPMC_A02)
N$29: C4.2 R11.2 U1.M20(B:OSC0_IN) Y1.P$1
N$30: C5.2 R11.1 U1.K20(B:OSC0_OUT) Y1.P$2
N$31: C6.2 R12.2 U1.H20(B:OSC1_IN) Y2.P$2
N$32: C7.2 R12.1 U1.F20(B:OSC1_OUT) Y2.P$1
N$33: C4.1 C5.1 U1.L20(B:OSC0_GND)
N$34: C6.1 C7.1 U1.G20(B:OSC1_GND)
N$35: R13.1 U1.B4(A:RTC_KALDO_ENN)
N$36: D2.2(C) R33.2
N$37: S3.1 S3.3 U1.U16(C:GPMC_A09)
N$39: U1.R13(C:GPMC_A00) U$1.P$1
N$40: FB2.2 X3.1(VBUS)
N$41: U1.T14(C:GPMC_A03) U$6.P$1
N$44: U1.B12(C:MCASP0_ACLKR) U$8.P$1
N$45: S4.1 S4.3 U1.V17(C:GPMC_A11)
N$46: R55.1 U1.U9(C:GPMC_CSN1)
N$47: U1.C13(C:MCASP0_FSR) U$7.P$1
N$51: R56.1 U8.5(WP) WP.P$1(TP)
N$53: AIN2.P$1 U1.B7(B:AIN2)
N$54: AIN3.P$1 U1.A7(B:AIN3)
N$56: AIN5.P$1 U1.B8(B:AIN5)
N$57: AIN6.P$1 U1.A8(B:AIN6)
N$59: R36.2 X2.VBUS
N$61: U1.A13(C:MCASP0_ACLKX) U$10.P$1
N$62: U1.A14(C:MCASP0_AHCLKX) U$11.P$1
N$64: D3.2(C) R57.2
N$65: D4.2(C) R58.2
N$66: D5.2(C) R59.2
N$67: D6.2(C) R60.2
N$68: C20.1 IC1.C2(VDDI)
PWM_2A: U1.U10(C:GPMC_AD08) U$12.P$1
PWM_2B: U1.T10(C:GPMC_AD09) U$13.P$1
SCK: SPI0_SCK.P$1 U1.A17(C:SPI0_SCLK)
SYS_ADC_1P8V: R2.1 U1.A4(B:SYS_ADC_1P8V) U1.A5(B:SYS_ADC_1P8V) U1.D8(B:SYS_ADC_1P8V) VDD_ADC.P$1(TP)
SYS_RSTN: C9.2 JTAG.15(SRST) R9.2 R10.2 U1.A10(A:WARMRSTN) WRST.TP
SYS_RTC_1P8V: Q1.C R8.1 U1.P9(A:SYS_RTC_1P8V) U1.P14(A:SYS_RTC_1P8V) U2.3(ANODE) U3.5(VCC)
SYS_VDD1_3P3V: C8.2 C13.1 C14.1 C15.1 C16.1 C17.1 C18.1 C19.1 C21.1 IC1.C6(VCCQ1) IC1.E6(VCC1) IC1.F5(VCC2) IC1.J10(VCC3) IC1.K9(VCC4) IC1.M4(VCCQ2) IC1.N4(VCCQ3) IC1.P3(VCCQ4) IC1.P5(VCCQ5) J1.4(VDD) JTAG.5(TVDD) R3.2 R4.2 R14.2 R16.2 R20.2 R21.2 R31.2 R35.2 R37.2 R38.2 R39.2 R40.2 R41.2 R42.2 R43.2 R44.2 R45.2 R46.2 R47.2 R48.2 R49.2 R50.2 R51.2 R52.2 R53.2 R54.2 R56.2 SYS_VDD1_3P3V.P$1(TP) U1.U20(A:SYS_VDD1_3P3V) U1.V20(A:SYS_VDD1_3P3V) U4.4(VCC) U8.4(VCC)
SYS_VDD2_3P3V: R5.2 SYS_VDD2_3P3V.P$1(TP) U1.Y11(A:SYS_VDD2_3P3V)
SYS_VDD_1P8V: U1.R16(A:SYS_VDD_1P8V)
SYS_VOUT: C11.+ SYS_VOUT.P$1(TP) U1.W4(A:SYS_VOUT) U1.Y4(A:SYS_VOUT) U5.2(IN1) U5.3(IN2)
UART0_RX: U1.E15(C:UART0_RXD) UART0_RXD.P$1
UART0_TX: U1.E16(C:UART0_TXD) UART0_TXD.P$1
USB0_DM: U1.N18(B:USB0_DM) U7.1(D-) X2.D-
USB0_DP: U1.N17(B:USB0_DP) U7.2(D+) X2.D+
USB0_ID: U1.P16(B:USB0_ID) U7.3(ID) X2.ID
USB1_DM: U1.R18(B:USB1_DM) U6.1(D-) X3.2(D-)
USB1_DP: U1.R17(B:USB1_DP) U6.2(D+) X3.3(D+)
USB1_DRVVBUS: R34.2 U1.F15(B:USB1_DRVVBUS) U5.4(EN)
USB1_OCN: R35.1 U1.T16(C:GPMC_A10) U5.5(!OC)
USB1_PWR: C10.1 FB1.2 FB2.1 U5.6(OUT1) U5.7(OUT2) U5.8(OUT3) U6.6(VBUS)
USB1_VBUS: FB1.1 U1.T18(B:USB1_VBUS)
USB_DC: C12.1 R36.1 U1.P15(B:USB0_VBUS) U1.Y8(A:VIN_USB) U1.Y9(A:VIN_USB) U7.6(VBUS) USB_DC.P$1(TP)
USR0: D3.1(A) U1.V15(C:GPMC_A05)
USR1: D4.1(A) U1.U15(C:GPMC_A06)
USR2: D5.1(A) U1.T15(C:GPMC_A07)
USR3: D6.1(A) U1.V16(C:GPMC_A08)
VDD_3V3A: Q1.E R6.2 R7.2 U1.R15(G:VDDSHV_3P3V) ; supply symbol labelled VDDSHV_3P3V
VDD_5V: U1.Y5(A:VIN_AC) U1.Y6(A:VIN_AC) VDD_5V.P$1(TP) X1.IN
Unconnected: JTAG.6(NC) U1.A2(G:VDD_MPU_MON) U1.A3(G:TESTOUT) U1.B1(F:NC) U1.B2(F:NC) U1.B3(F:NC) U1.B6(B:AIN0) U1.B13(C:MCASP0_FSX) U1.C1(F:NC) U1.C2(F:NC) U1.C3(F:NC) U1.C4(F:NC) U1.C7(B:AIN1) U1.C8(B:AIN4) U1.C9(B:AIN7) U1.C10(G:CAP_VBB_MPU) U1.C12(C:MCASP0_AHCLKR) U1.C18(C:ECAP0_IN_PWM0_OUT) U1.D1(F:NC) U1.D2(F:NC) U1.D3(F:NC) U1.D4(F:NC) U1.D5(F:NC) U1.D6(G:CAP_VDD_RTC) U1.D9(G:CAP_VDD_SRAM_CORE) U1.D10(A:SYS_VDD_1P8V) U1.D11(G:CAP_VDD_SRAM_MPU) U1.D12(C:MCASP0_AXR0) U1.D13(C:MCASP0_AXR1) U1.D15(C:UART1_TXD) U1.D16(C:UART1_RXD) U1.D17(C:UART1_RTSN) U1.D18(C:UART1_CTSN) U1.E1(F:NC) U1.E2(F:NC) U1.E3(F:NC) U1.E4(F:NC) U1.E6(A:SYS_RTC_1P8V) U1.E11(G:VDDSHV_3P3V) U1.E12(G:VDDSHV_3P3V) U1.E13(G:VDDSHV_3P3V) U1.E14(A:SYS_RTC_1P8V) U1.E17(C:UART0_RTSN) U1.E18(C:UART0_CTSN) U1.F1(F:NC) U1.F2(F:NC) U1.F3(F:NC) U1.F4(F:NC) U1.F5(G:VDDS_DDR) U1.F7(G:VDD_CORE) U1.F9(A:SYS_RTC_1P8V) U1.F11(G:VDD_MPU) U1.F12(G:VDD_MPU) U1.F13(G:VDD_MPU) U1.F14(G:VDDSHV_3P3V) U1.F16(B:USB0_DRVVBUS) U1.G1(F:NC) U1.G2(F:NC) U1.G3(F:NC) U1.G4(F:NC) U1.G5(G:VDDS_DDR) U1.G6(G:VDD_CORE) U1.G7(G:VDD_CORE) U1.G10(G:VDD_CORE) U1.G13(G:VDD_MPU) U1.G14(G:VDDSHV_3P3V) U1.H1(F:NC) U1.H2(F:NC) U1.H3(F:NC) U1.H4(F:NC) U1.H5(G:VDDS_DDR) U1.H11(G:VDD_CORE) U1.H13(G:VDD_MPU) U1.H14(G:VDDSHV_3P3V) U1.H15(G:VDDS_PLL) U1.H16(D:MII1_COL) U1.H17(D:MII1_CRS) U1.H18(D:RMII1_REF_CLK) U1.J1(F:NC) U1.J2(F:NC) U1.J3(F:NC) U1.J4(F:NC) U1.J5(G:VDDS_DDR) U1.J12(G:VDD_CORE) U1.J13(G:VDD_MPU) U1.J14(G:VDDSHV_3P3V) U1.J15(D:MII1_RX_ER) U1.J16(D:MII1_TX_EN) U1.J17(D:MII1_RX_DV) U1.J18(D:MII1_TXD3) U1.K1(F:NC) U1.K2(F:NC) U1.K3(F:NC) U1.K4(F:NC) U1.K5(G:VDDS_DDR) U1.K6(G:VDD_CORE) U1.K8(G:VDD_CORE) U1.K12(G:VDD_CORE) U1.K13(A:SYS_RTC_1P8V) U1.K14(G:VDDSHV_3P3V) U1.K15(D:MII1_TXD2) U1.K16(D:MII1_TXD1) U1.K17(D:MII1_TXD0) U1.K18(D:MII1_TX_CLK) U1.L1(F:NC) U1.L2(F:NC) U1.L3(F:NC) U1.L4(F:NC) U1.L5(G:VDDS_DDR) U1.L6(G:VDD_CORE) U1.L7(G:VDD_CORE) U1.L8(G:VDD_CORE) U1.L9(G:VDD_CORE) U1.L14(G:VDDSHV_3P3V) U1.L15(D:MII1_RXD1) U1.L16(D:MII1_RXD2) U1.L17(D:MII1_RXD3) U1.L18(D:MII1_RX_CLK) U1.M1(F:NC) U1.M2(F:NC) U1.M3(F:NC) U1.M4(F:NC) U1.M5(G:VPP) U1.M11(G:VDD_CORE) U1.M13(G:VDD_CORE) U1.M15(B:USB0_CE) U1.M16(D:MII1_RXD0) U1.M17(D:MDIO) U1.M18(D:MDC) U1.N1(F:NC) U1.N2(F:NC) U1.N3(F:NC) U1.N4(F:NC) U1.N5(G:VDDSHV_3P3V) U1.N6(A:SYS_RTC_1P8V) U1.N8(G:VDD_CORE) U1.N9(G:VDD_CORE) U1.N12(G:VDD_CORE) U1.N13(G:VDD_CORE) U1.N15(G:VDDSHV_3P3V) U1.N16(A:SYS_VDD_1P8V) U1.P1(F:NC) U1.P2(F:NC) U1.P3(F:NC) U1.P4(F:NC) U1.P5(G:VDDSHV_3P3V) U1.P6(G:VDDSHV_3P3V) U1.P7(G:VDDSHV_3P3V) U1.P8(G:VDDSHV_3P3V) U1.P10(G:VDDSHV_3P3V) U1.P11(G:VDDSHV_3P3V) U1.P12(G:VDDSHV_3P3V) U1.P13(G:VDDSHV_3P3V) U1.P18(B:USB1_CE) U1.R5(D:LCD_HSYNC) U1.R6(D:LCD_AC_BIAS_EN) U1.R7(C:GPMC_ADVN_ALE) U1.R10(G:VDDS_PLL) U1.R11(G:VDDS_PLL) U1.T6(C:GPMC_BEN0_CLE) U1.T7(C:GPMC_OEN_REN) U1.T11(C:GPMC_AD10) U1.T13(C:GPMC_CSN3) U1.T17(C:GPMC_WAIT0) U1.U5(D:LCD_VSYNC) U1.U6(C:GPMC_WEN) U1.U11(F:NC) U1.U12(C:GPMC_AD11) U1.U13(C:GPMC_AD15) U1.U17(C:GPMC_WPN) U1.U18(C:GPMC_BEN1) U1.V5(D:LCD_PCLK) U1.V6(C:GPMC_CSN0) U1.V10(F:NC) U1.V11(F:NC) U1.V12(C:GPMC_CLK) U1.V13(C:GPMC_AD14) U1.V14(C:GPMC_A01) U1.Y13(G:EXTL1A) U1.Y14(G:EXTL1B) U1.Y16(G:EXTL2A) U1.Y17(G:EXTL2B) U1.Y19(G:EXTL3A) U1.Y20(G:EXTL3B) U3.1(NC) U6.3(ID) U6.5(N.C.) U7.5(N.C.) X1.OUT_CON

## Notes on the sheet
- User Leds
- USB host | Boot configuration: 0x4018
- Falta conectar todas las señales del USB al SiP
- Va a un GPIO
- Coger el más conveniente para el ruteado
- Circuitería de Reset
- JTAG
- GPIO0_8
- GPIO0_9
- eMMC
- GPA0
- GPA3
- Coger el más conveniente para el ruteado
- GPIO3_14
- eQEP0A
- eQEP0B
- PWM_2A
- GPIO3_21 | PWM_2B
- eQEP2A
- Busqueda con recuadro: show @ R43 | eQEP2B
- uSD CARD | EEPROM

## Library data of the parts
5V_BAT GND GND3 SYS_RTC_1P8V SYS_VDD1_3P3V SYS_VDD2_3P3V SYS_VDD_1P8V SYS_VOUT T_BAT USB_DC V_BAT VDD_5V VDD_ADC VDD_CORE VDD_MPU VDDS_DDR VDDS_PLL VDDSHV_3P3V = OSD3358_BAS_RefDesignParts:TESTPAD/W_HOLE_1X1: Test point (Through hole)
AIN2 AIN3 AIN5 AIN6 SCL SDA SPI0_CS SPI0_MISO SPI0_MOSI SPI0_SCK U$1-U$8 U$10-U$13 UART0_RXD UART0_TXD = added:HOLE
C1-C9 = OSD3358_BAS_RefDesignParts:C: Capacitor SMD. Sizes: 0402, 0603 & 0805
C10 C12-C21 = OSD3358_BAS_RefDesignParts_L2:C: Capacitor SMD. Sizes: 0402, 0603 & 0805
C11 = OSD3358_BAS_RefDesignParts_L2:CPOL-US: POLARIZED CAPACITOR, American symbol
D1-D6 = OSD3358_BAS_RefDesignParts:LTST-C191TBKT: PointLED® Enhanced Thinfilm LED TOP & BOTTOM mount EIA-STD, P47F
FB1 FB2 = OSD3358_BAS_RefDesignParts_L2:MPZ2012S601AT000: INDUCTOR SMD Ferrite Bead Packages: 0805, 1206
GND. WP = OSD3358_BAS_RefDesignParts_L2:TESTPAD/W_HOLE_1X1: Test point (Through hole)
IC1 = OSD3358_BAS_RefDesignParts_L2:EMMC04G-S100-B08U
J1 = 104031-0811:104031-0811: 1.10mm Pitch microSD Memory Card Connector, SMT, Push-Pull Type, 1.42mm Height, with Detect Switch; AVAILABILITY: Unavailable; DESCRIPTION: 1.10mm Pitch microSD Memory Card Connector, SMT, Push-Pull Type, 1.42mm Height, with Detect Switch; MF: Molex, LLC; MP: 104031-0811; PACKAGE: None; PRICE: None
JTAG = OSD3358_BAS_RefDesignParts:CTI-JTAG
LPGD NINT NWKP PGD PWREN WRST = OSD3358_BAS_RefDesignParts:TP: Test pad
MGT1-MGT4 = OSD3358_BAS_RefDesignParts:MOUNTING_HOLE: Chassis Mounting Hole w/GND connection ability
Q1 = OSD3358_BAS_RefDesignParts:MMBT2907*: PNP Transistror
R1-R33 R36-R43 R57-R60 = OSD3358_BAS_RefDesignParts:R-US_: RESISTOR, American symbol
R34 R35 R44-R56 = OSD3358_BAS_RefDesignParts_L2:R-US_: RESISTOR, American symbol
S1-S4 = OSD3358_BAS_RefDesignParts:KMR231GLFS
U1 = OSD3358_BAS_RefDesignParts:OSD3358-512M-BAS: Octavo Systems LLC OSD335x Family SiP: 27mm x 27mm, 1.27mm pitch 400 pin BGA contains AM3358, 512MB DDR3, TPS65217, TL5209 and passives. Commerical Temperature: 0C to 85C.
U2 = OSD3358_BAS_RefDesignParts:TLVH431
U3 = OSD3358_BAS_RefDesignParts:SN74LVC1G07_DCK_5; DATASHEETURL: http://www.ti.com/lit/gpn/SN74LVC1G07; FAMILY_NAME: LL BUFFER AND DRIVER WITH OPEN-DRAIN OUTPUT; GENERIC_PART_NUMBER: SN74LVC1G07; INDUSTRY_STD_PKG_TYPE: SC70; MANUFACTURER: Texas Instruments; MANUFACTURER_PART_NUMBER: sn74lvc1g07_dck_5; PACKAGE_DESIGNATOR: DCK; PIN_COUNT: 5; VENDOR: Texas Instruments
U4 = OSD3358_BAS_RefDesignParts:APX811: Diodes APX811/812 4-pin Microprocessor Supervisor with Manual Reset. Datasheet <https://www.diodes.com/assets/Datasheets/APX811_812.pdf> Footprint <https://www.diodes.com/assets/Package-Files/SOT143.pdf> Digikey <http://www.digikey.com/products/en?keywords=APX811-29UG-7DICT-ND> Footprint compatible devices: STM811 <http://www.st.com/content/st_com/en/products/reset-and-supervisor-ics/resets-and-voltage-detectors/stm811.html> Digikey <http://www.digikey.com/product-detail/en/stmicroelectronics/STM811SW16F/497-3348-1-ND> STM6315 <http://www.st.com/content/st_com/en/products/reset-and-supervisor-ics/resets-and-voltage-detectors/stm6315.html> Digikey <http://www.digikey.com/product-detail/en/stmicroelectronics/STM6315SDW13F/497-4975-1-ND> ADM811
U5 = OSD3358_BAS_RefDesignParts_L2:TPS2051
U6 U7 = OSD3358_BAS_RefDesignParts_L2:TPD4S012_DRY_6; DATASHEETURL: http://www.ti.com/lit/gpn/TPD4S012; FAMILY_NAME: ESD Solution; GENERIC_PART_NUMBER: TPD4S012; INDUSTRY_STD_PKG_TYPE: SON; MANUFACTURER: Texas Instruments; MANUFACTURER_PART_NUMBER: tpd4s012_dry_6; PACKAGE_DESIGNATOR: DRY; PIN_COUNT: 6; VENDOR: Texas Instruments
U8 = OSD3358_BAS_RefDesignParts_L2:24LC32A: 32K i2c Serial EEPROM
X1 = OSD3358_BAS_RefDesignParts:PJ-102B_POWER_CON
X2 = OSD3358_BAS_RefDesignParts:10118192-0001LF: Amphenol FCI Micro USB Type B Complete Surface Mount (SMT) no guide holes
X3 = OSD3358_BAS_RefDesignParts_L2:USB_HOST_W/CHASSIS_GND
Y1 = OSD3358_BAS_RefDesignParts:7A-24.000MAAJ-T
Y2 = OSD3358_BAS_RefDesignParts:ABS07-32.768KHZ-T